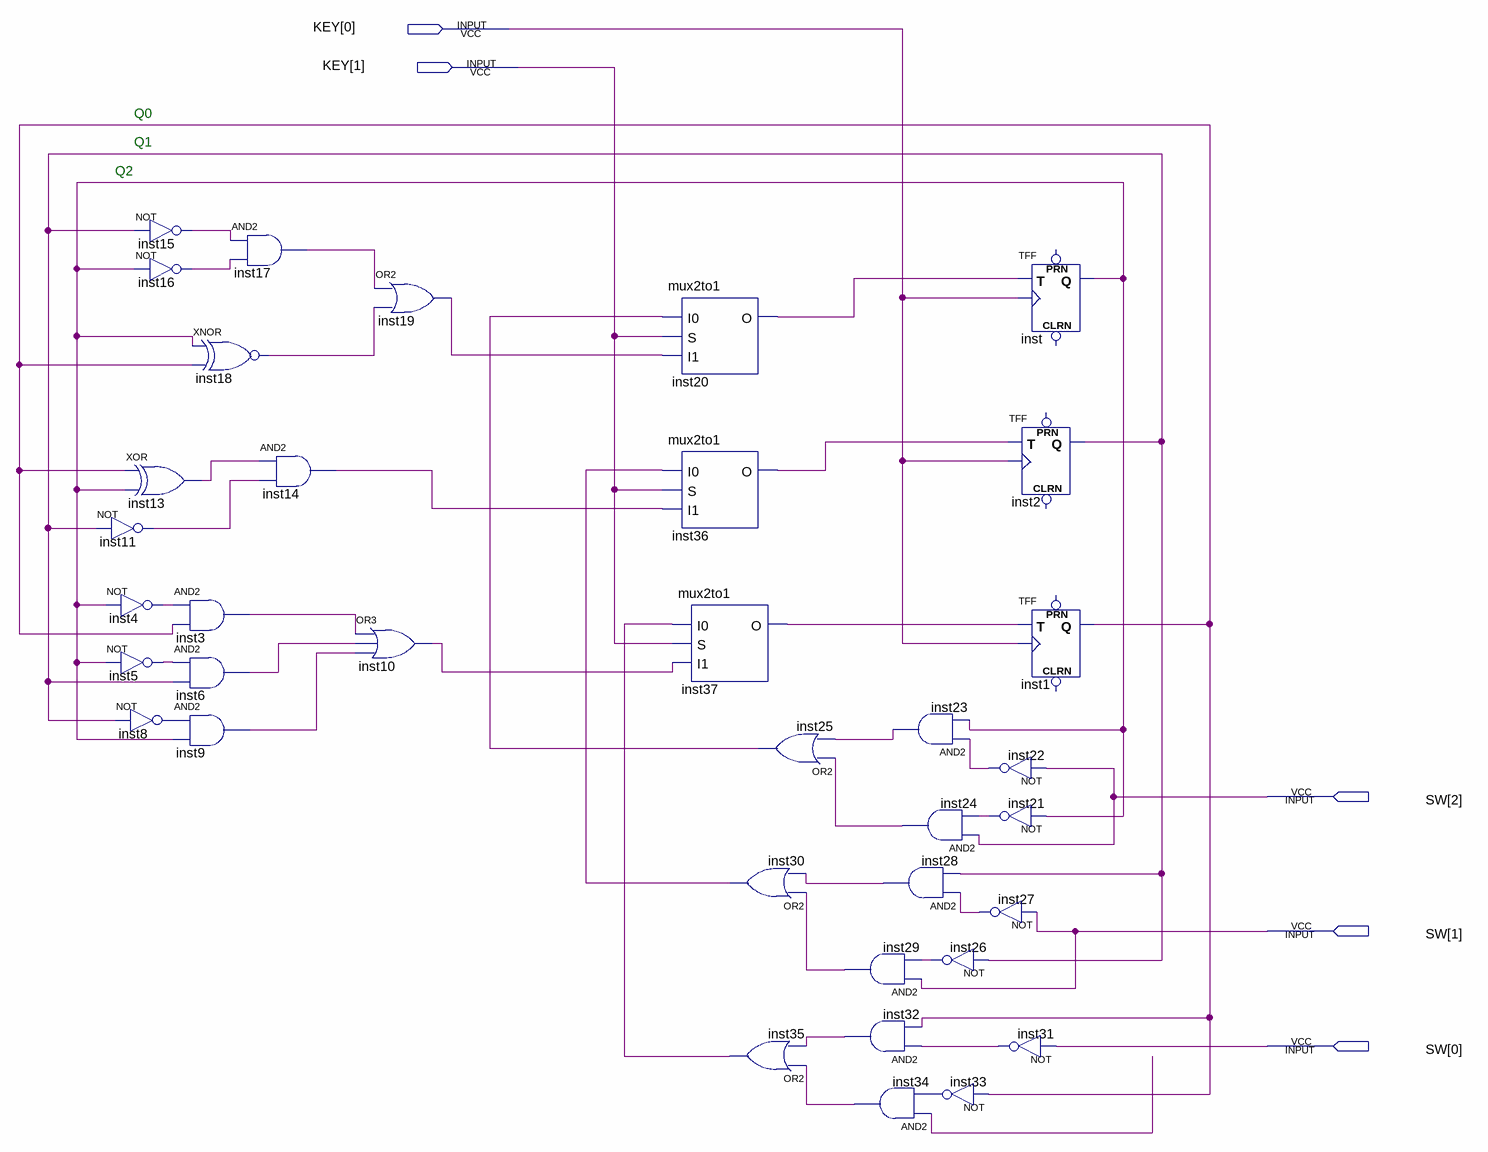
[diagram p0: schematic sheet]
// Quartus schematic Block2.bdf as structural Verilog: 36 symbols, 5 pins
module Block2 (
  input  [1:0] KEY,
  input  [2:0] SW
);

  wire inst1_q, inst2_q, inst3_out, inst4_out, inst5_out, inst6_out, inst8_out, inst9_out, inst10_out,
       inst11_out, inst13_out, inst14_out, inst15_out, inst16_out, inst17_out, inst18_out, inst19_out,
       inst20_o, inst21_out, inst22_out, inst23_out, inst24_out, inst25_out, inst26_out, inst27_out,
       inst28_out, inst29_out, inst30_out, inst31_out, inst32_out, inst33_out, inst34_out, inst35_out,
       inst36_o, inst37_o, inst_q, undriven;

  not inst11 (inst11_out, inst2_q);
  not inst4 (inst4_out, inst_q);
  not inst5 (inst5_out, inst_q);
  not inst8 (inst8_out, inst2_q);
  not inst15 (inst15_out, inst2_q);
  not inst16 (inst16_out, inst_q);
  xnor inst18 (inst18_out, inst_q, inst1_q);
  xor inst13 (inst13_out, inst1_q, inst_q);
  and inst3 (inst3_out, inst4_out, inst1_q);
  and inst6 (inst6_out, inst5_out, inst2_q);
  and inst9 (inst9_out, inst8_out, inst_q);
  and inst17 (inst17_out, inst15_out, inst16_out);
  and inst14 (inst14_out, inst13_out, inst11_out);
  or inst19 (inst19_out, inst17_out, inst18_out);
  or inst10 (inst10_out, inst3_out, inst6_out, inst9_out);
  mux2to1 inst20 (.I0(inst25_out), .S(KEY[1]), .I1(inst19_out), .O(inst20_o));
  mux2to1 inst36 (.I0(inst30_out), .S(KEY[1]), .I1(inst14_out), .O(inst36_o));
  mux2to1 inst37 (.I0(inst35_out), .S(KEY[1]), .I1(inst10_out), .O(inst37_o));
  or inst30 (inst30_out, inst29_out, inst28_out);
  or inst35 (inst35_out, inst34_out, inst32_out);
  or inst25 (inst25_out, inst24_out, inst23_out);
  and inst28 (inst28_out, inst27_out, inst2_q);
  and inst29 (inst29_out, SW[1], inst26_out);
  and inst32 (inst32_out, inst31_out, inst1_q);
  and inst34 (inst34_out, undriven, inst33_out);
  and inst23 (inst23_out, inst22_out, inst_q);
  and inst24 (inst24_out, SW[2], inst21_out);
  not inst26 (inst26_out, inst2_q);
  not inst33 (inst33_out, inst1_q);
  TFF inst (.T(inst20_o), .CLK(KEY[0]), .Q(inst_q));  // open: PRN, CLRN
  TFF inst2 (.T(inst36_o), .CLK(KEY[0]), .Q(inst2_q));  // open: PRN, CLRN
  TFF inst1 (.T(inst37_o), .CLK(KEY[0]), .Q(inst1_q));  // open: PRN, CLRN
  not inst22 (inst22_out, SW[2]);
  not inst21 (inst21_out, inst_q);
  not inst27 (inst27_out, SW[1]);
  not inst31 (inst31_out, SW[0]);

  // Notes on the sheet:
  //   Q0
  //   Q1
  //   Q2
endmodule
